# EAGLE design NeoCoreShield2 (EAGLE 9.6.2)
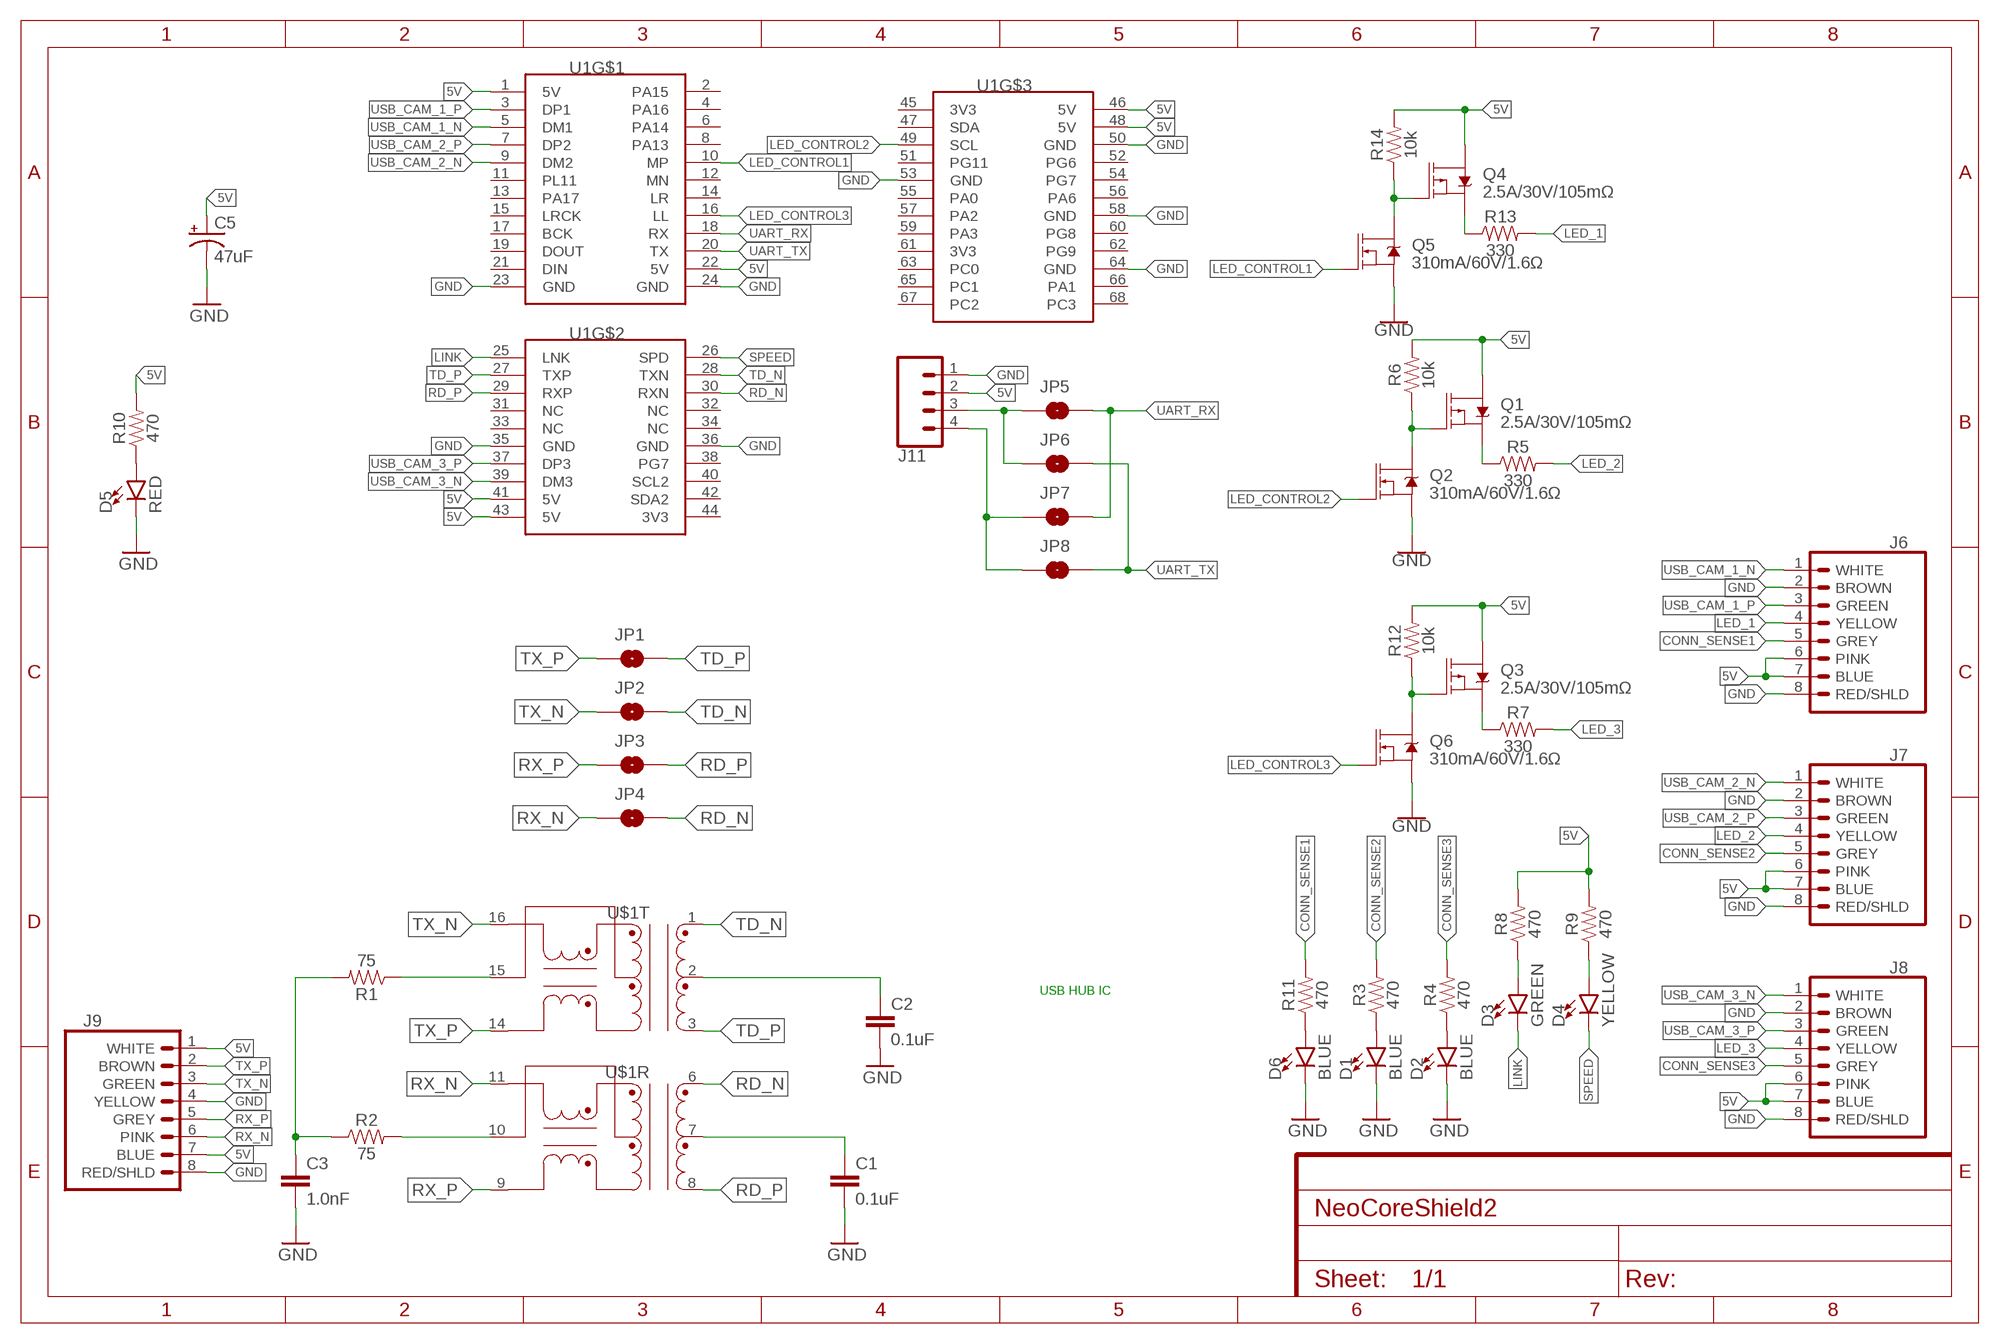
[diagram p0: schematic, sheet 1]

## Parts
C1  0.1uF  0.1UF-0603-25V-(+80/-20%)  [0603]
C2  0.1uF  0.1UF-0603-25V-(+80/-20%)  [0603]
C3  1.0nF  1.0UF-1206-50V-10%  [1206]
C5  47uF  47UF-POLAR-PANASONIC_D-35V-20%  [PANASONIC_D]
D1  BLUE  LED-0805  [0805]
D2  BLUE  LED-0805  [0805]
D3  GREEN  LED-0805  [0805]
D4  YELLOW  LED-0805  [0805]
D5  RED  LED-0805  [0805]
D6  BLUE  LED-0805  [0805]
J6  BINDER_M12_PAR_8_DIP  [BINDER_M12_PAR_8_DIP]
J7  BINDER_M12_PAR_8_DIP  [BINDER_M12_PAR_8_DIP]
J8  BINDER_M12_PAR_8_DIP  [BINDER_M12_PAR_8_DIP]
J9  BINDER_M12_PAR_8_DIP  [BINDER_M12_PAR_8_DIP]
J11  CONN_04  [1X04]
JP1  JUMPER-SMT_2_NO_SILK  [SMT-JUMPER_2_NO_SILK]
JP2  JUMPER-SMT_2_NO_SILK  [SMT-JUMPER_2_NO_SILK]
JP3  JUMPER-SMT_2_NO_SILK  [SMT-JUMPER_2_NO_SILK]
JP4  JUMPER-SMT_2_NO_SILK  [SMT-JUMPER_2_NO_SILK]
JP5  JUMPER-SMT_2_NO_SILK  [SMT-JUMPER_2_NO_SILK]
JP6  JUMPER-SMT_2_NO_SILK  [SMT-JUMPER_2_NO_SILK]
JP7  JUMPER-SMT_2_NO_SILK  [SMT-JUMPER_2_NO_SILK]
JP8  JUMPER-SMT_2_NO_SILK  [SMT-JUMPER_2_NO_SILK]
Q1  2.5A/30V/105mΩ  MOSFET_PCH-DMG2307L  [SOT23-3]
Q2  310mA/60V/1.6Ω  MOSFET-NCH-2N7002PW  [SOT323]
Q3  2.5A/30V/105mΩ  MOSFET_PCH-DMG2307L  [SOT23-3]
Q4  2.5A/30V/105mΩ  MOSFET_PCH-DMG2307L  [SOT23-3]
Q5  310mA/60V/1.6Ω  MOSFET-NCH-2N7002PW  [SOT323]
Q6  310mA/60V/1.6Ω  MOSFET-NCH-2N7002PW  [SOT323]
R1  75  75KOHM-0603-1/10W-1%  [0603]
R2  75  75KOHM-0603-1/10W-1%  [0603]
R3  470  0OHM-0603-1/10W-5%  [0603]
R4  470  0OHM-0603-1/10W-5%  [0603]
R5  330  RESISTOR0805  [0805]
R6  10k  10KOHM-0603-1/10W-1%  [0603]
R7  330  RESISTOR0805  [0805]
R8  470  0OHM-0603-1/10W-5%  [0603]
R9  470  0OHM-0603-1/10W-5%  [0603]
R10  470  0OHM-0603-1/10W-5%  [0603]
R11  470  0OHM-0603-1/10W-5%  [0603]
R12  10k  10KOHM-0603-1/10W-1%  [0603]
R13  330  RESISTOR0805  [0805]
R14  10k  10KOHM-0603-1/10W-1%  [0603]
U1  NANO_PI_NEO_CORE  [NANO_PI_NEO_CORE]
U$1  ETH-TRANS  [SOIC-16-WIDE]

## Nets
5V: C5.+ J6.6(PINK) J6.7(BLUE) J7.6(PINK) J7.7(BLUE) J8.6(PINK) J8.7(BLUE) J9.1(WHITE) J9.7(BLUE) J11.2 Q1.3(D) Q3.3(D) Q4.3(D) R6.2 R8.2 R9.2 R10.2 R12.2 R14.2 U1.1(5V) U1.22(5V) U1.41(5V) U1.43(5V) U1.46(5V) U1.48(5V)
CONN_SENSE1: J6.5(GREY) R11.2
CONN_SENSE2: J7.5(GREY) R3.2
CONN_SENSE3: J8.5(GREY) R4.2
ETH_TD0_GND: C1.1 U$1.7(R:CT)
ETH_TD1_GND: C2.1 U$1.2(T:CT)
ETH_TERM_MID: C3.1 R1.2 R2.1
GND: C1.2 C2.2 C3.2 C5.- D1.C D2.C D5.C D6.C J6.2(BROWN) J6.8(RED/SHLD) J7.2(BROWN) J7.8(RED/SHLD) J8.2(BROWN) J8.8(RED/SHLD) J9.4(YELLOW) J9.8(RED/SHLD) J11.1 Q2.2(S) Q5.2(S) Q6.2(S) U1.23(GND) U1.24(GND) U1.35(GND) U1.36(GND) U1.50(GND) U1.53(GND) U1.58(GND) U1.64(GND)
LED_1: J6.4(YELLOW) R13.2
LED_2: J7.4(YELLOW) R5.2
LED_3: J8.4(YELLOW) R7.2
LED_CONTROL1: Q5.1(G) U1.10(MP)
LED_CONTROL2: Q2.1(G) U1.49(SCL)
LED_CONTROL3: Q6.1(G) U1.16(LL)
LINK: D3.C U1.25(LNK)
LINK_MID: D3.A R8.1
N$1: D1.A R3.1
N$2: D2.A R4.1
N$3: R2.2 U$1.10(R:XCT)
N$4: D6.A R11.1
N$5: Q3.2(S) R7.1
N$6: Q3.1(G) Q6.3(D) R12.1
N$7: D5.A R10.1
N$8: Q1.2(S) R5.1
N$9: Q1.1(G) Q2.3(D) R6.1
N$10: Q4.2(S) R13.1
N$11: R1.1 U$1.15(T:XCT)
N$12: Q4.1(G) Q5.3(D) R14.1
RD_N [diff]: JP4.2 U1.30(RXN) U$1.6(R:D+)
RD_P [diff]: JP3.2 U1.29(RXP) U$1.8(R:D-)
RX_N [diff]: J9.6(PINK) JP4.1 U$1.11(R:X+)
RX_P [diff]: J9.5(GREY) JP3.1 U$1.9(R:X-)
SPEED: D4.C U1.26(SPD)
SPEED_MID: D4.A R9.1
TD_N [diff]: JP2.2 U1.28(TXN) U$1.1(T:D+)
TD_P [diff]: JP1.2 U1.27(TXP) U$1.3(T:D-)
TX_N [diff]: J9.3(GREEN) JP2.1 U$1.16(T:X+)
TX_P [diff]: J9.2(BROWN) JP1.1 U$1.14(T:X-)
UART_RX: JP5.2 JP7.2 U1.18(RX)
UART_RX_TX: J11.3 JP5.1 JP6.1
UART_TX: JP6.2 JP8.2 U1.20(TX)
UART_TX_RX: J11.4 JP7.1 JP8.1
USB_CAM_1_N [diff]: J6.1(WHITE) U1.5(DM1)
USB_CAM_1_P [diff]: J6.3(GREEN) U1.3(DP1)
USB_CAM_2_N [diff]: J7.1(WHITE) U1.9(DM2)
USB_CAM_2_P [diff]: J7.3(GREEN) U1.7(DP2)
USB_CAM_3_N [diff]: J8.1(WHITE) U1.39(DM3)
USB_CAM_3_P [diff]: J8.3(GREEN) U1.37(DP3)
Unconnected: U1.2(PA15) U1.4(PA16) U1.6(PA14) U1.8(PA13) U1.11(PL11) U1.12(MN) U1.13(PA17) U1.14(LR) U1.15(LRCK) U1.17(BCK) U1.19(DOUT) U1.21(DIN) U1.31(NC) U1.32(NC) U1.33(NC) U1.34(NC) U1.38(PG7) U1.40(SCL2) U1.42(SDA2) U1.44(3V3) U1.45(3V3) U1.47(SDA) U1.51(PG11) U1.52(PG6) U1.54(PG7) U1.55(PA0) U1.56(PA6) U1.57(PA2) U1.59(PA3) U1.60(PG8) U1.61(3V3) U1.62(PG9) U1.63(PC0) U1.65(PC1) U1.66(PA1) U1.67(PC2) U1.68(PC3)

## Notes on the sheet
- USB HUB IC

## Library data of the parts
C1 C2 = SparkFun-Capacitors:0.1UF: 0.1µF ceramic capacitors A capacitor is a passive two-terminal electrical component used to store electrical energy temporarily in an electric field.; PROD_ID: CAP-00810
C3 = SparkFun-Capacitors:1.0UF: 1µF ceramic capacitors A capacitor is a passive two-terminal electrical component used to store electrical energy temporarily in an electric field.; PROD_ID: CAP-09822; VALUE: 1.0uF
C5 = Panasonic 47 uF cap - EEE-1CA470SP:47UF-POLAR: 47µF polarized capacitors A capacitor is a passive two-terminal electrical component used to store electrical energy temporarily in an electric field.; PROD_ID: CAP-08478
D1-D6 = LED-0805:LED-0805; VALUE: COLOR
J6-J9 = Panel Mounts Connectors:BINDER_M12_PAR_8_DIP: Binder: 86-0231-0000-00008
J11 = SparkFun-Connectors:CONN_04: Multi connection point. Often used as Generic Header-pin footprint for 0.1 inch spaced/style header connections On any of the 0.1 inch spaced packages, you can populate with these: Break Away Headers - Straight <https://www.sparkfun.com/products/116> (PRT-00116) Break Away Male Headers - Right Angle <https://www.sparkfun.com/products/553> (PRT-00553) Female Headers <https://www.sparkfun.com/products/115> (PRT-00115) Break Away Headers - Machine Pin <https://www.sparkfun.com/products/117> (PRT-00117) Break Away Female Headers - Swiss Machine Pin <https://www.sparkfun.com/products/743> (PRT-00743) For SCREWTERMINALS and SPRING TERMINALS visit here: Screw Terimnals on SparkFun.com <https://www.sparkfun.com/search/results?term=Screw+Terminals> (5mm/3.5mm/2.54mm spacing) This device is also useful as a general connection point to wire up your design to another part of your project. Our various solder wires solder well into these plated through hole pads. Hook-Up Wire - Assortment (Stranded, 22 AWG) <https://www.sparkfun.com/products/11375> (PRT-11375) Hook-Up Wire - Assortment (Solid Core, 22 AWG) <https://www.sparkfun.com/products/11367> (PRT-11367) View the entire wire category on our website here <https://www.sparkfun.com/categories/141> Special notes: Molex polarized connector foot print use with SKU : PRT-08231 with associated crimp pins and housings. 1MM SMD Version SKU: PRT-10208; PROD_ID: CONN-09696
JP1-JP8 = SparkFun-Jumpers:JUMPER-SMT_2_NO: Normally open jumper This jumper has two pads in close proximity to each other. Apply solder to close the connection. Round pads are easier to solder for beginners, but are a lot larger. SparkFun Product that uses the round pads: SparkFun EL Sequencer <https://www.sparkfun.com/products/12781>
Q1 Q3 Q4 = SparkFun-DiscreteSemi:MOSFET_PCH: P-channel MOSFETs Voltage controlled devices that allow control of high current outputs. SparkFun Products: SparkFun ESP32 Thing <https://www.sparkfun.com/products/13907> SparkFun ESP8266 Thing <https://www.sparkfun.com/products/13231>; PROD_ID: TRANS-11308
Q2 Q5 Q6 = SparkFun-DiscreteSemi:MOSFET-NCH: N-channel MOSFETs Voltage controlled devices that allow control of high current outputs. SparkFun Products: SparkFun OpenScale <https://www.sparkfun.com/products/13261> SparkFun Digital Sandbox <https://www.sparkfun.com/products/12651> SparkFun Monster Moto Shield <https://www.sparkfun.com/products/10182> SparkFun MOSFET Power Controller <https://www.sparkfun.com/products/11214>; PROD_ID: TRANS-11151
R1 R2 = SparkFun-Resistors:75KOHM: 75Ω resistor A resistor is a passive two-terminal electrical component that implements electrical resistance as a circuit element. Resistors act to reduce current flow, and, at the same time, act to lower voltage levels within circuits. - Wikipedia; PROD_ID: RES-09737
R3 R4 R8-R11 = SparkFun-Resistors:0OHM: 0Ω resistor A resistor is a passive two-terminal electrical component that implements electrical resistance as a circuit element. Resistors act to reduce current flow, and, at the same time, act to lower voltage levels within circuits. - Wikipedia; PROD_ID: RES-08609; VALUE: 0
R5 R7 R13 = SparkFun-Resistors:RESISTOR: Generic Resistor Package
R6 R12 R14 = SparkFun-Resistors:10KOHM: 10kΩ resistor A resistor is a passive two-terminal electrical component that implements electrical resistance as a circuit element. Resistors act to reduce current flow, and, at the same time, act to lower voltage levels within circuits. - Wikipedia; PROD_ID: RES-00824
U1 = NanoPiNeoCore:NANO_PI_NEO_CORE
U$1 = ethernet transformer:ETH-TRANS

## Net classes
0 default: width 0.203 mm
1 diff: width 0.203 mm, clearance 0.203 mm

## Board
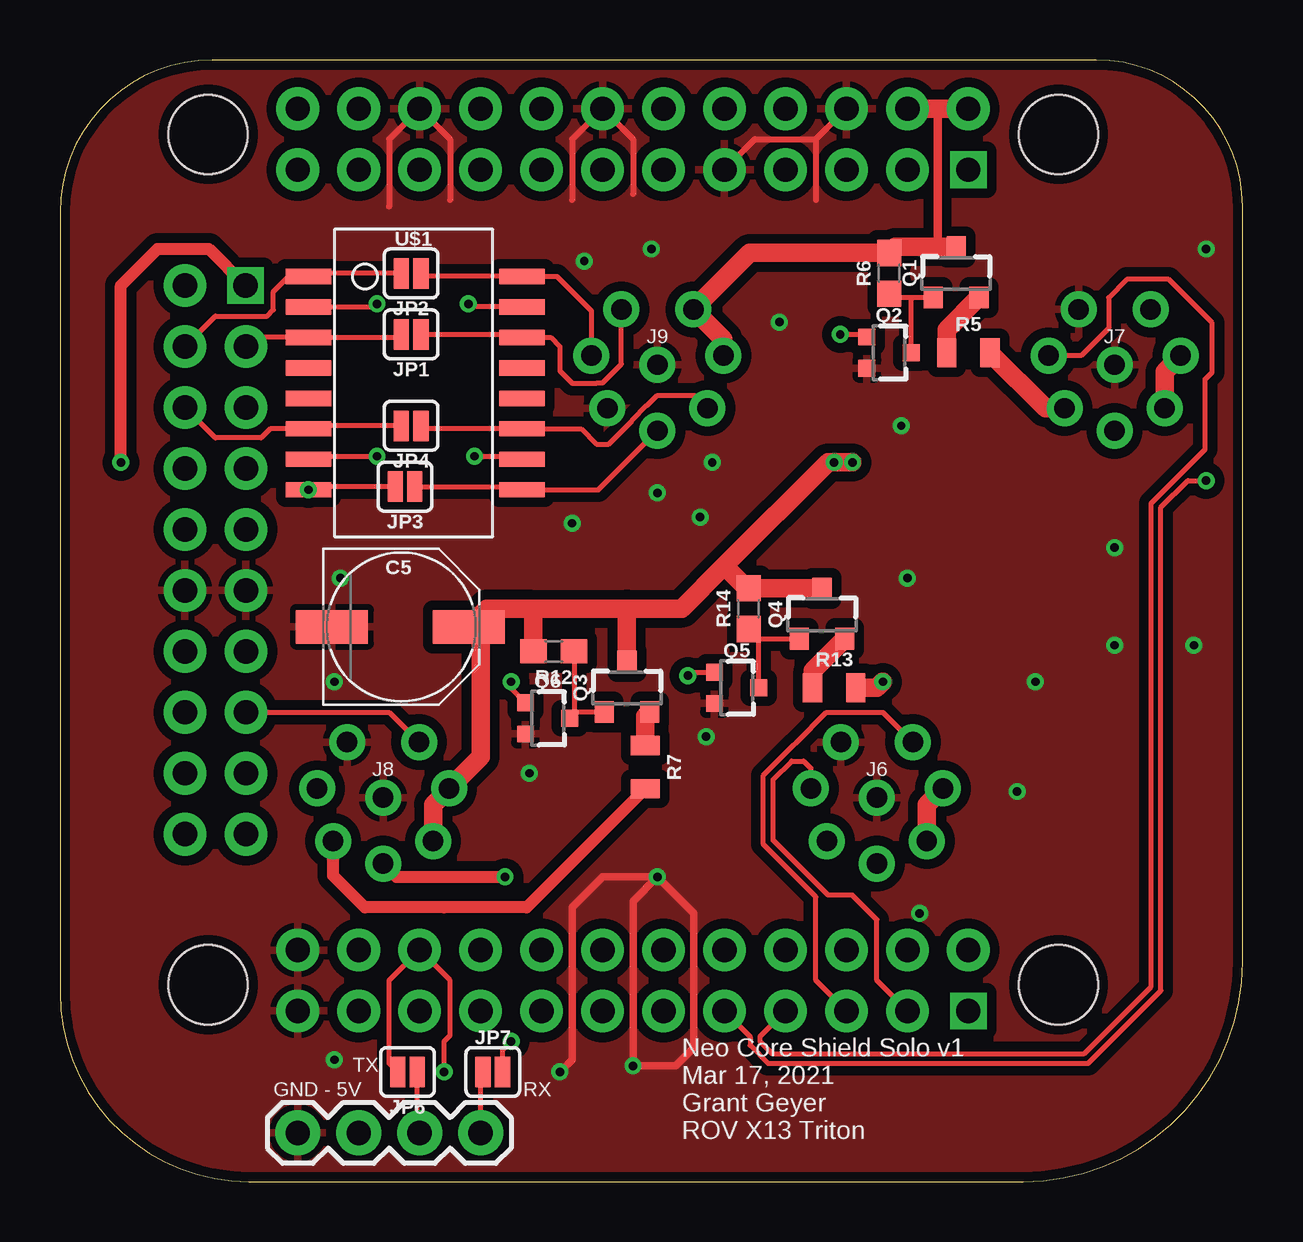
[diagram p1: board, top side]
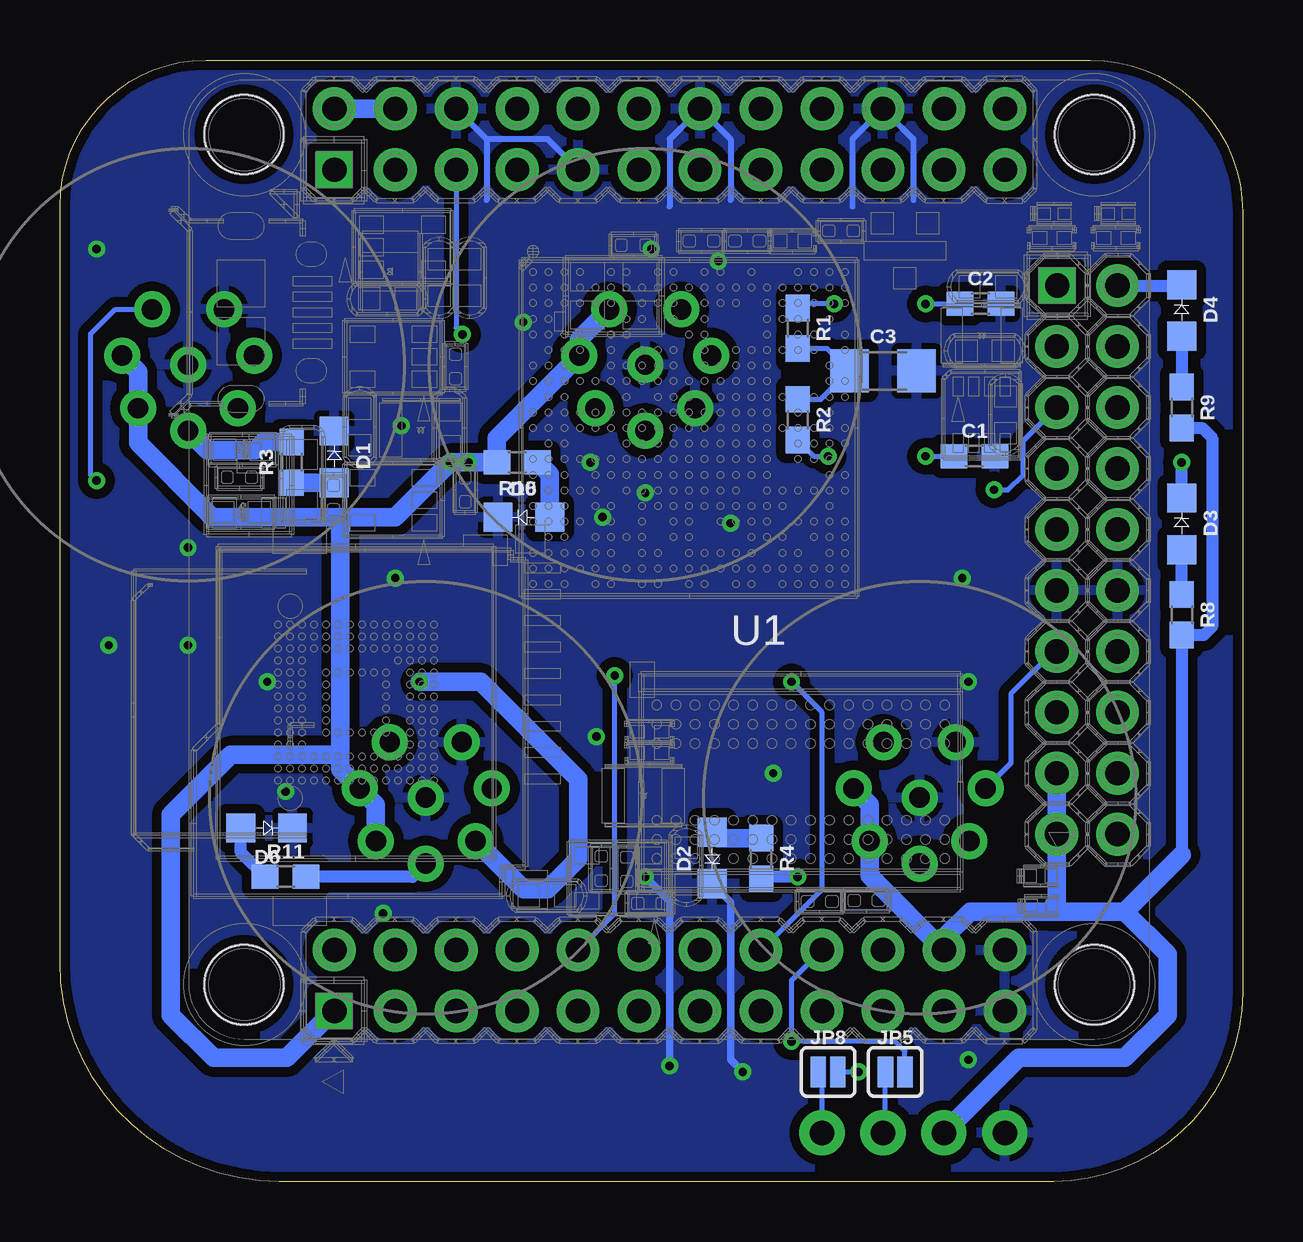
[diagram p2: board, bottom side, seen from below]

Size 49.28 x 46.74 mm. Coordinates in mm from the lower left corner, seen from the top.
Outline: 0,40.39 0,7.87 arc90 7.87,0 40.13,0 arc90 49.28,9.14 49.28,40.64 arc90 43.18,46.74 6.35,46.74 arc90 0,40.39
Copper layers (1*16): Top 0.0356mm / dielectric 1.5011mm / Bottom 0.0356mm
Design rules "ECE_Senior_Design": minimum track width 8mil, minimum drill 13mil, track to track 8mil, track to pad 8mil, pad to pad 6mil, via to via 8mil, smd to smd 6mil, copper to edge 15mil, drill to drill 8mil, minimum pad ring 7mil, minimum via ring 7mil, stop-mask expansion 3mil, vias tented up to drill 0mil, thermal gap 10mil

### Footprints (pad centres in the part's own frame; a part is rotated, then mirrored left to right if it is on the bottom)
0603 = smd 1.1 x 1: 1 -0.85,0; 2 0.85,0
1206 = smd 1.6 x 1.8: 1 -1.4,0; 2 1.4,0
PANASONIC_D = smd 3 x 1.4: + 2.8,0; - -2.9,0
0805 = smd 1.2 x 1.2: A 1.1,0; C -1.05,0
BINDER_M12_PAR_8_DIP = drill 0.85 pad 1.5: 1 -1.5,-2.31; 2 1.5,-2.31; 3 2.75,-0.38; 4 2.08,1.81; 5 0,2.75; 6 -2.08,1.81; 7 -2.75,-0.38; 8 0,0
1X04 = drill 1.016 pad 1.88: 1 0,0; 2 2.54,0; 3 5.08,0; 4 7.62,0
SMT-JUMPER_2_NO_SILK = smd 0.635 x 1.27: 1 -0.406,0; 2 0.406,0
SOT23-3 = smd 0.8 x 0.9: 1 -0.95,-1; 2 0.95,-1; 3 0,1.1
SOT323 = smd 0.7 x 0.7: 1 -0.65,-0.925; 2 0.65,-0.925; 3 0,0.925
0805' = smd 0.8 x 1.2: 1 -0.9,0; 2 0.9,0
NANO_PI_NEO_CORE = drill 1.016 square: 1 0,0; 25 30.124,30.226; 45 0,35.052 | drill 1.016 pad 1.778: 2 0,2.54; 3 2.54,0; 4 2.54,2.54; 5 5.08,0; 6 5.08,2.54; 7 7.62,0; 8 7.62,2.54; 9 10.16,0; 10 10.16,2.54; 11 12.7,0; 12 12.7,2.54; 13 15.24,0; 14 15.24,2.54; 15 17.78,0; 16 17.78,2.54; 17 20.32,0; 18 20.32,2.54; 19 22.86,0; 20 22.86,2.54; 21 25.4,0; 22 25.4,2.54; 23 27.94,0; 24 27.94,2.54; 26 32.639,30.226; 27 30.099,27.686; 28 32.639,27.686; 29 30.099,25.146; 30 32.639,25.146; 31 30.099,22.606; 32 32.639,22.606; 33 30.099,20.066; 34 32.639,20.066; 35 30.099,17.526; 36 32.639,17.526; 37 30.099,14.986; 38 32.639,14.986; 39 30.099,12.446; 40 32.639,12.446; 41 30.099,9.906; 42 32.639,9.906; 43 30.099,7.366; 44 32.639,7.366; 46 0,37.592; 47 2.54,35.052; 48 2.54,37.592; 49 5.08,35.052; 50 5.08,37.592; 51 7.62,35.052; 52 7.62,37.592; 53 10.16,35.052; 54 10.16,37.592; 55 12.7,35.052; 56 12.7,37.592; 57 15.24,35.052; 58 15.24,37.592; 59 17.78,35.052; 60 17.78,37.592; 61 20.32,35.052; 62 20.32,37.592; 63 22.86,35.052; 64 22.86,37.592; 65 25.4,35.052; 66 25.4,37.592; 67 27.94,35.052; 68 27.94,37.592 | hole 3.302: -3.759,1.092; 31.674,1.092; 31.674,36.525; -3.759,36.525
SOIC-16-WIDE = smd 0.64 x 1.9: 1 -4.445,-4.38; 2 -3.175,-4.38; 3 -1.905,-4.38; 4 -0.635,-4.38; 5 0.635,-4.38; 6 1.905,-4.38; 7 3.175,-4.38; 8 4.445,-4.38; 9 4.445,4.51; 10 3.175,4.51; 11 1.905,4.51; 12 0.635,4.51; 13 -0.635,4.51; 14 -1.905,4.51; 15 -3.175,4.51; 16 -4.445,4.51

### Placement (x,y rotation side)
C1  11.18,30.23 0 bottom
C2  10.92,36.58 0 bottom
C3  14.99,33.78 0 bottom
C5  14.22,23.11 0 top
D1  37.85,30.23 270 bottom
D2  22.1,13.46 90 bottom
D3  2.54,27.43 270 bottom
D4  2.54,36.32 270 bottom
D5  29.97,27.69 0 bottom
D6  40.64,14.73 180 bottom
J6  34.04,16 180 top
J7  43.94,34.04 180 top
J8  13.46,16 180 top
J9  24.89,34.04 180 top
J11  9.91,2.03 0 top
JP1  14.63,35.31 180 top
JP2  14.63,37.85 180 top
JP3  14.38,28.96 180 top
JP4  14.63,31.5 180 top
JP5  14.48,4.57 0 bottom
JP6  14.48,4.57 180 top
JP7  18.03,4.57 0 top
JP8  17.27,4.57 0 bottom
Q1  37.34,37.85 0 top
Q2  34.54,34.54 270 top
Q3  23.62,20.57 0 top
Q4  31.75,23.62 0 top
Q5  28.19,20.57 270 top
Q6  20.32,19.3 270 top
R1  18.54,35.56 270 bottom
R2  18.54,31.75 270 bottom
R3  39.62,29.97 90 bottom
R4  20.07,13.46 270 bottom
R5  330  [0805']  37.85,34.54 0 top
R6  34.54,37.85 90 top
R7  330  [0805']  24.38,17.27 270 top
R8  2.54,23.62 270 bottom
R9  2.54,32.26 270 bottom
R10  30.23,29.97 180 bottom
R11  39.88,12.7 0 bottom
R12  20.57,22.1 180 top
R13  330  [0805']  32.26,20.57 0 top
R14  28.7,23.88 90 top
U1  37.85,7.11 0 bottom
U$1  14.73,33.27 270 top

### Tracks (layer width: path | path; a pad name or v marks a point on that pad's centre or on a via)
5V  (via drill 0.35)
  Top 0.356: 36.58,38.95 36.58,44.7
  Top 0.762: J9.7 27.64,35.1 J9.1 28.74,38.7 R6.2 34.79,38.95 36.58,38.95 Q1.3 | J6.7 36.12,15.71 J6.6 | U1.46 36.58,44.7 U1.48 | 19.56,23.88 19.72,23.71 R12.2 | 27.69,25.65 32,29.97 v32.26,29.97 v33.02,29.97 | 27.69,25.65 25.91,23.88 23.62,23.88 | 19.56,23.88 23.62,23.88 | Q3.3 23.62,23.88 | Q4.3 R14.2 28.61,24.73 27.69,25.65 | 19.56,23.88 17.79,23.88 C5.+ 17.53,22.61 17.53,17.7 J8.7 15.54,15.71 J8.6 | J7.6 46.02,33.75 J7.7
  Bottom 0.508: R9.2 1.69,31.41 1.27,30.99 1.27,23.11 1.61,22.77 R8.2 2.54,13.62
  Bottom 0.762: U1.41 U1.43 7.75,11.63 8.13,11.25 | J9.1 27.64,35.1 J9.7 31.08,30.98 R10.2 v32.26,29.97 v33.02,29.97 35.31,27.69 37.59,27.69 | 37.59,27.69 42.93,27.69 46.02,30.78 J7.6 46.02,33.75 J7.7 | J6.6 36.12,15.71 J6.7 37.59,17.19 37.59,17.78 | U1.48 U1.46 | 37.59,27.69 37.59,17.78 | 4.91,11.25 3.12,9.47 3.12,6.94 4.91,5.16 9.32,5.16 J11.2 | 8.13,11.25 4.91,11.25 | 8.13,11.25 11.35,11.25 12.45,10.16 U1.22 15.54,12.75 J8.6 15.54,15.71 J8.7 | 37.59,17.78 42.16,17.78 44.65,15.29 44.65,6.94 42.87,5.16 39.84,5.16 37.88,7.11 U1.1 | 2.54,13.62 4.91,11.25
CONN_SENSE1
  Bottom 0.508: J6.5 34.59,12.7 R11.2
CONN_SENSE2
  Bottom 0.762: R3.2 40.81,30.82 41.15,30.48 43.14,30.48 J7.5
CONN_SENSE3  (via drill 0.35)
  Top 0.508: J8.5 14.01,12.7 v18.54,12.7
  Bottom 0.508: v18.54,12.7 19.98,12.7 R4.2
ETH_TD0_GND  (via drill 0.35)
  Top 0.203: U$1.7 10.48,30.23 v13.21,30.23
  Bottom 0.203: v13.21,30.23 C1.1
ETH_TD1_GND  (via drill 0.35)
  Top 0.203: U$1.2 13.08,36.45 v13.21,36.58
  Bottom 0.203: v13.21,36.58 C2.1
ETH_TERM_MID
  Bottom 0.203: R1.2 17.31,34.71 C3.1 17.57,32.6 R2.1
GND  (via drill 0.35)
  Top 0.254: 13.72,40.64 13.72,43.43 U1.64 16.26,43.43 16.26,40.89 | 21.34,40.89 21.34,43.43 U1.58 23.88,43.43 23.88,41.15 | U1.53 28.96,43.43 31.5,43.43 | U1.50 31.5,43.43 | 31.5,43.43 31.5,40.89
  Top 0.305: v24.89,12.7 23.88,11.68 v23.88,4.83 25.65,4.83 26.42,5.59 26.42,11.18 v24.89,12.7 | v24.89,12.7 22.61,12.7 21.34,11.43 21.34,5.08 v20.83,4.57
  Bottom 0.254: 16.26,40.64 16.26,43.43 U1.64 13.72,43.43 13.72,40.89 | 21.34,40.89 21.34,43.43 U1.58 23.88,43.43 23.88,40.64 | U1.50 31.5,43.43 | 31.5,43.43 31.5,40.89 | U1.53 28.96,43.43 31.5,43.43
  Bottom 0.305: v24.89,12.7 23.88,11.68 v23.88,4.83 | v20.83,4.57 21.34,5.08 21.34,11.65 D2.C
  other vias: 19.56,17.02 26.92,18.54 35.81,11.18 39.88,16.26 40.64,20.83 43.94,22.35 47.24,22.35 35.31,25.15 35.05,31.5 27.18,29.97 26.67,27.69 11.68,25.15 11.43,20.83 21.34,27.43 21.84,38.35 11.43,5.08 43.94,26.42 47.75,38.86 24.89,28.7 24.64,38.86 29.97,35.81
  pour Top (isolate 0.406, rank 6): -1.78,-2.54 112.01,-2.54 112.01,136.65 -1.78,136.65
  pour Bottom (isolate 0.406, rank 6): -1.02,-1.78 107.44,-1.78 107.44,133.1 -1.02,133.1
LED_1  (via drill 0.35)
  Top 0.762: v34.29,20.83 34.04,20.57 R13.2
  Bottom 0.762: J6.4 29.96,12.19 28.96,12.19 27.69,13.46 27.69,16.76 31.75,20.83 v34.29,20.83
LED_2
  Top 0.762: R5.2 41.06,32.23 J7.4
LED_3
  Top 0.508: R7.2 19.44,11.43 16,11.43 12.7,11.43 11.38,12.75 J8.4
LED_CONTROL1  (via drill 0.35)
  Top 0.203: v26.16,21.08 26.3,21.22 Q5.1
  Bottom 0.203: U1.10 26.16,11.18 v26.16,21.08
LED_CONTROL2  (via drill 0.35)
  Top 0.203: v32.51,35.31 33.51,35.31 Q2.1
  Bottom 0.203: U1.49 32.77,35.56 v32.51,35.31
LED_CONTROL3  (via drill 0.35)
  Top 0.203: Q6.1 18.8,20.55 v18.8,20.83
  Bottom 0.203: U1.16 17.53,12.19 17.53,19.56 v18.8,20.83
LINK  (via drill 0.35)
  Top 0.508: v2.54,29.97 2.54,37.34 4.06,38.86 6.2,38.86 U1.25
  Bottom 0.508: D3.C v2.54,29.97
LINK_MID
  Bottom 0.508: R8.1 D3.A
N$1
  Bottom 0.762: D1.A R3.1
N$2
  Bottom 0.762: R4.1 21.85,14.31 D2.A
N$3  (via drill 0.35)
  Top 0.203: v17.27,30.23 19.11,30.23 U$1.10
  Bottom 0.203: R2.2 17.87,30.23 v17.27,30.23
N$4
  Bottom 0.508: R11.1 41.74,13.71 D6.A
N$5
  Top 0.762: R7.1 24.38,19.39 Q3.2
N$6
  Top 0.203: Q3.1 21.52,19.57 Q6.3 21.42,19.48 R12.1
N$7
  Bottom 0.762: R10.1 28.87,29.47 D5.A
N$8
  Top 0.762: R5.1 36.95,35.5 Q1.2
N$9
  Top 0.203: 34.69,36.85 35.56,36.85 | 35.56,36.85 Q1.1 | Q2.3 35.47,36.76 35.56,36.85
  Top 0.762: 34.69,36.85 R6.1
N$10
  Top 0.762: R13.1 31.36,21.28 Q4.2
N$11  (via drill 0.35)
  Top 0.203: U$1.15 17.14,36.45 v17.02,36.58
  Bottom 0.203: v17.02,36.58 18.38,36.58 R1.1
N$12
  Top 0.203: Q5.3 29.12,22.61 R14.1 29.11,22.62 Q4.1
RD_N
  Top 0.203: JP4.2 10.48,31.5 U$1.6 8.76,31.37 8.38,30.99 6.48,30.99 U1.30
RD_P  (via drill 0.35)
  Top 0.203: JP3.2 10.48,28.96 U$1.8
  Bottom 0.203: U$1.8 9.78,28.83 9.14,29.46 9.14,30.86 U1.29
  other vias: 10.35,28.83
RX_N
  Top 0.203: J9.6 26.43,32.77 24.89,32.77 24.47,32.34 24.45,32.34 23.84,31.72 23.84,31.71 22.86,30.73 22.35,30.73 21.72,31.37 U$1.11 15.16,31.37 JP4.1
RX_P
  Top 0.203: JP3.1 19.11,28.96 U$1.9 22.43,28.83 J9.5
SPEED
  Bottom 0.508: U1.26 2.57,37.34 D4.C
SPEED_MID
  Bottom 0.508: D4.A R9.1
TD_N
  Top 0.203: JP2.2 10.48,37.85 U$1.1 9.53,37.72 8.89,37.08 8.89,36.32 8.64,36.07 6.48,36.07 U1.28
TD_P
  Top 0.203: JP1.2 14.1,35.18 U$1.3 8.13,35.18 U1.27
TX_N
  Top 0.203: J9.3 22.14,36.28 20.7,37.72 U$1.16 15.16,37.72 JP2.1
TX_P
  Top 0.203: JP1.1 19.11,35.31 U$1.14 20.45,35.18 20.83,34.8 20.83,33.78 21.34,33.27 22.37,33.27 22.38,33.28 22.61,33.28 23.39,34.06 J9.2
UART_RX  (via drill 0.35)
  Top 0.203: JP7.2 18.44,5.49 v18.8,5.84
  Bottom 0.203: U1.18 18.8,8.38 v18.8,5.84 14.48,5.84 14.07,5.44 JP5.2
UART_RX_TX
  Top 0.203: J11.3 14.88,2.13 JP6.1
  Bottom 0.203: J11.3 14.88,2.13 JP6.1
UART_TX  (via drill 0.35)
  Top 0.203: JP6.2 13.72,4.93 13.72,8.38 U1.20 16.26,8.38 16.26,6.1 16,5.84 v16,4.57
  Bottom 0.203: JP8.2 v16,4.57
UART_TX_RX
  Top 0.203: J11.4 17.53,4.47 JP7.1
  Bottom 0.203: J11.4 17.53,4.47 JP8.1
USB_CAM_1_N
  Top 0.203: U1.5 31.5,8.38 31.5,11.87 29.31,14.06 29.31,16.93 30.57,18.19 30.69,18.31 31.94,19.56 34.29,19.56 J6.1
USB_CAM_1_P
  Top 0.203: U1.3 34.04,8.38 34.04,10.92 33.02,11.94 32,11.94 29.72,14.22 29.72,16.76 30.48,17.53 30.99,17.53 31.29,17.23 J6.3
USB_CAM_2_N  (via drill 0.35)
  Top 0.203: U1.9 28.75,6.04 28.75,5.67 29.5,4.93 42.84,4.93 45.87,7.96 45.87,28.09 46.99,29.21 v47.75,29.21
  Bottom 0.203: v47.75,29.21 48.01,29.46 48.01,35.31 46.97,36.35 J7.1
USB_CAM_2_P
  Top 0.203: U1.7 29.16,6.04 29.16,5.84 29.67,5.33 42.67,5.33 45.47,8.13 45.47,28.26 47.72,30.51 47.72,33.44 48,33.73 48,35.79 46.2,37.59 44.45,37.59 43.69,36.83 43.69,35.56 42.54,34.42 J7.3
USB_CAM_3_N
  Top 0.203: J8.1 13.72,19.56 U1.39
USB_CAM_3_P
  Bottom 0.203: U1.37 7.87,22.1 9.65,20.32 9.65,17.44 J8.3

### Text on the board
tNames: TX | GND - 5V | RX | Neo Core Shield Solo v1 / Mar 17, 2021 / Grant Geyer / ROV X13 Triton